# Altium schematic sheet LC - Communication Board.SchDoc: Communication Board
size A4; SheetNumber: 1; SheetTotal: 1; Version: 1.1; Variant: Variant; Modification: Mod; Project: Loght Control
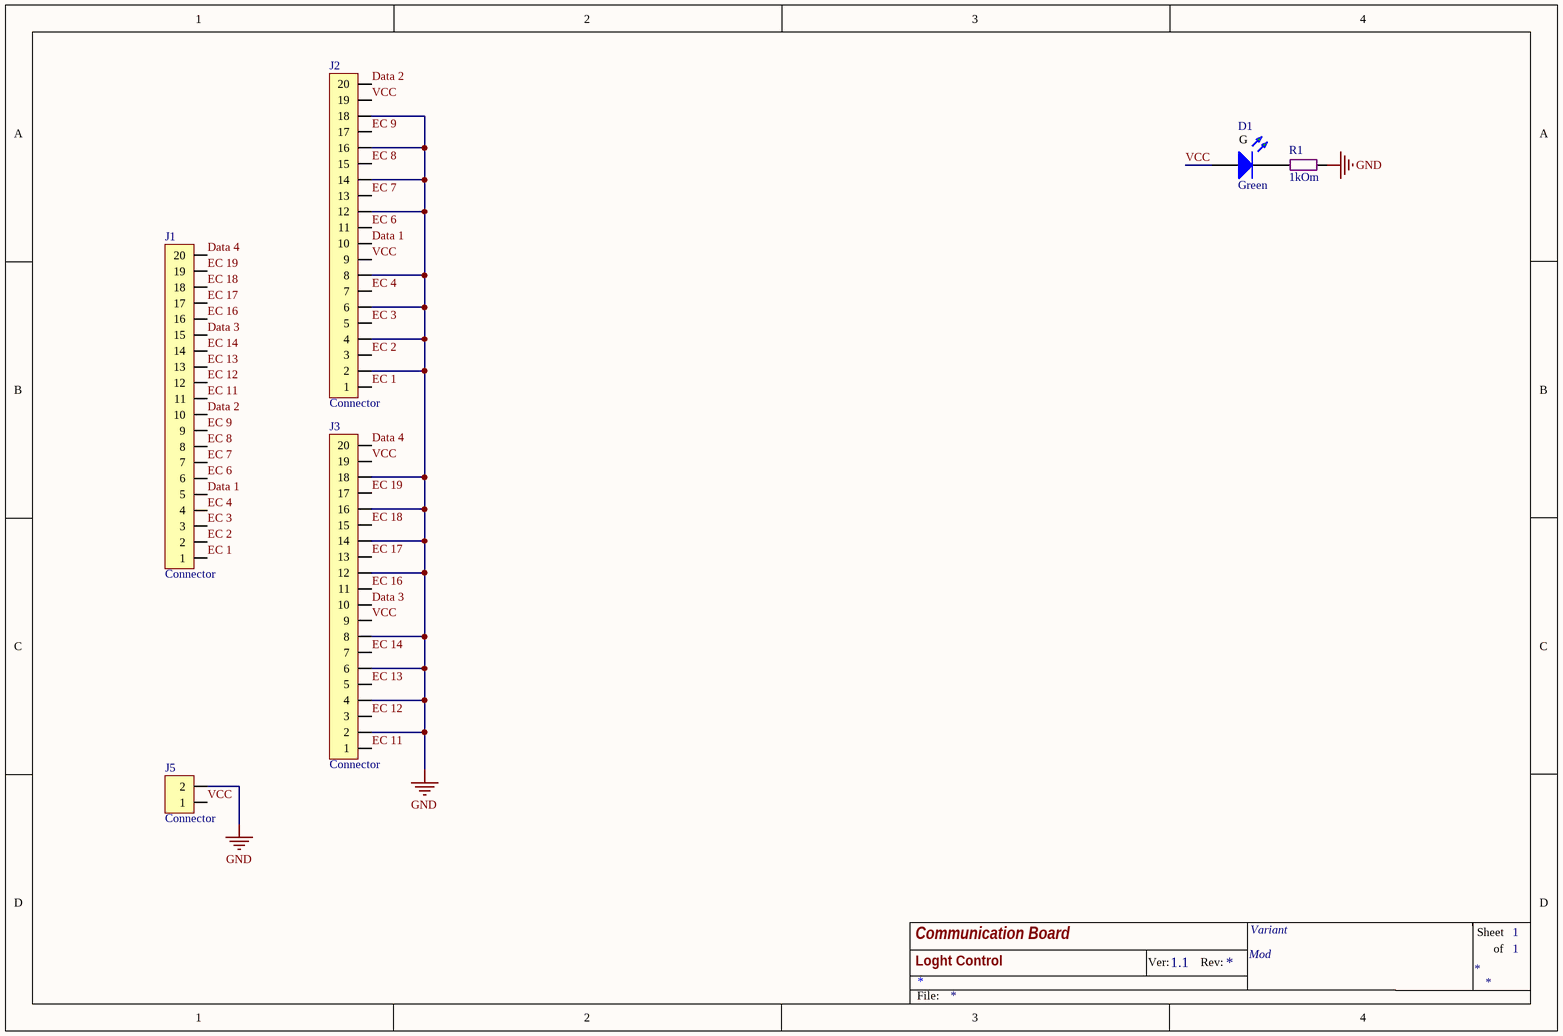
[diagram p0: LC - Communication Board.SchDoc]

## Parts
D1  Green  [LED SMD 0805 Green]
J1  Connector  [LINE 2.54 x 20D (2 x 10) - BH]
J2  Connector  [LINE 2.54 x 20D (2 x 10) - BH]
J3  Connector  [LINE 2.54 x 20D (2 x 10) - BH]
J5  Connector  [DG301 5mm 2p]
R1  1kOm  [SMD 0805 (2012)]

## Nets
GND: J2.2 J2.4 J2.6 J2.8 J2.12 J2.14 J2.16 J2.18 J3.2 J3.4 J3.6 J3.8 J3.12 J3.14 J3.16 J3.18 J5.2 R1.2
Data 1: J1.5 J2.10
Data 2: J1.10 J2.20
Data 3: J1.15 J3.10
Data 4: J1.20 J3.20
EC 1: J1.1 J2.1
EC 2: J1.2 J2.3
EC 3: J1.3 J2.5
EC 4: J1.4 J2.7
EC 6: J1.6 J2.11
EC 7: J1.7 J2.13
EC 8: J1.8 J2.15
EC 9: J1.9 J2.17
EC 11: J1.11 J3.1
EC 12: J1.12 J3.3
EC 13: J1.13 J3.5
EC 14: J1.14 J3.7
EC 16: J1.16 J3.11
EC 17: J1.17 J3.13
EC 18: J1.18 J3.15
EC 19: J1.19 J3.17
VCC: D1.A J2.9 J2.19 J3.9 J3.19 J5.1
NetD1_K: D1.K R1.1

## Notes on the sheet
- Ver:
- Rev:
- Sheet
- of
- File:
- (in symbol Led SMD Green) G

## Library data of the parts
D1 = Led SMD Green: ?2v ?20mA; Forward Voltage TYP: ?2; Resistor for 5v VCC: 330 Om; Forward Voltage Min: ?; Wave len min/typ: ?; Liminous Min (mcd): ?; Liminous Typ (mcd): ?; Forward Amp (mA): ?; Color: Green
J1-J3 = PLD-20 (2 x 10): Vert, Dbl line, Male
J5 = DG301-5.0-2P12: DG301 series
R1 = Res SMD 0805